# Altium schematic sheet FinalSchematic.SchDoc
size B
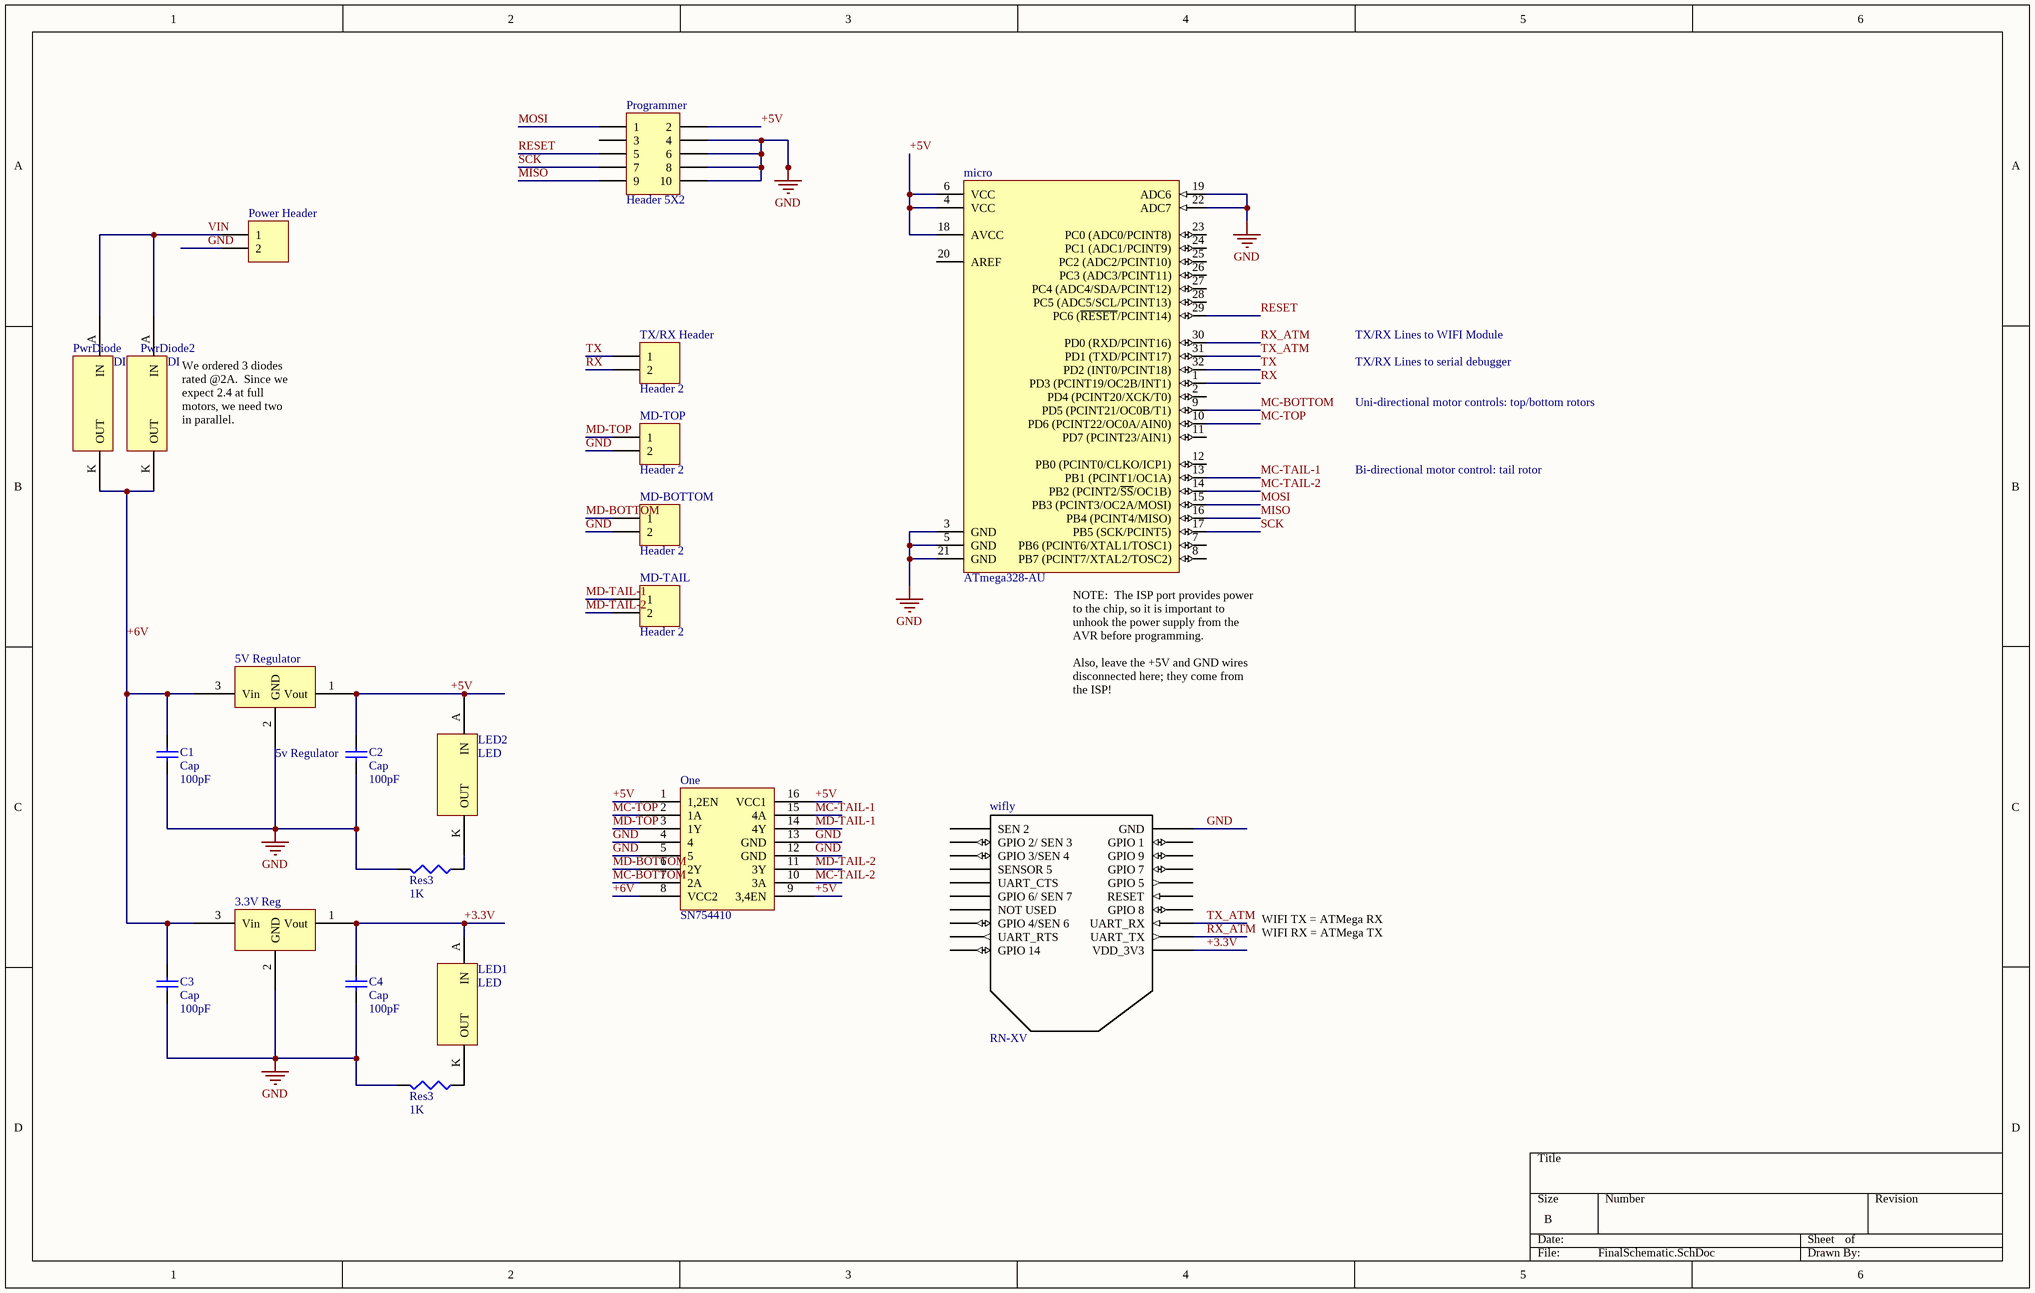
[diagram p0: FinalSchematic.SchDoc]

## Parts
3.3V_Reg  TO-220 3.3 V Regulator  [SOT89-150P410X160-3N]  (value not drawn)
5V_Regulator  5v Regulator  [SOT89-150P360X170-3N]
C1  Cap  value 100pF  [C1206]
C2  Cap  value 100pF  [C0805]
C3  Cap  value 100pF  [C1206]
C4  Cap  value 100pF  [C0805]
LED1  LED  [LEDFixed]
LED2  LED  [LEDFixed]
MD-BOTTOM  Header 2  [HDR1X2]
MD-TAIL  Header 2  [HDR1X2]
MD-TOP  Header 2  [HDR1X2]
micro  ATmega328-AU  [32A_L]
One  SN754410  [DIP-16]
Power_Header  Header 2  [HDR1X2]  (value not drawn)
Programmer  Header 5X2  [HDR2X5]
PwrDiode  DIODE  [Diode]
PwrDiode2  DIODE  [Diode]
R5  Res3  value 1K  [J1-0603]
R6  Res3  value 1K  [J1-0603]
TX/RX_Header  Header 2  [HDR1X2]
wifly  RN-XV  [XBEE]

## Nets
GND: 3.3V_Reg.2(GND) 5V_Regulator.2(GND) C1.1 C2.1 C3.1 C4.1 MD-BOTTOM.2 MD-TOP.2 micro.3(GND) micro.5(GND) micro.19(ADC6) micro.21(GND) micro.22(ADC7) One.4 One.5 One.12(GND) One.13(GND) Power_Header.2 Programmer.4 Programmer.6 Programmer.8 Programmer.10 R5.2 R6.2 wifly.10(GND)
+3.3V: 3.3V_Reg.1(Vout) C4.2 LED1.A(IN) wifly.1(VDD_3V3)
+5V: 5V_Regulator.1(Vout) C2.2 LED2.A(IN) micro.4(VCC) micro.6(VCC) micro.18(AVCC) One.1(1,2EN) One.9(3,4EN) One.16(VCC1) Programmer.2
+6V: 3.3V_Reg.3(Vin) 5V_Regulator.3(Vin) C1.2 C3.2 One.8(VCC2) PwrDiode.K(OUT) PwrDiode2.K(OUT)
MC-BOTTOM: micro.9(PD5_(PCINT21/OC0B/T1)) One.7(2A)
MC-TAIL-1: micro.13(PB1_(PCINT1/OC1A)) One.15(4A)
MC-TAIL-2: micro.14(PB2_(PCINT2/~{SS}/OC1B)) One.10(3A)
MC-TOP: micro.10(PD6_(PCINT22/OC0A/AIN0)) One.2(1A)
MD-BOTTOM: MD-BOTTOM.1 One.6(2Y)
MD-TAIL-1: MD-TAIL.1 One.14(4Y)
MD-TAIL-2: MD-TAIL.2 One.11(3Y)
MD-TOP: MD-TOP.1 One.3(1Y)
MISO: micro.16(PB4_(PCINT4/MISO)) Programmer.9
MOSI: micro.15(PB3_(PCINT3/OC2A/MOSI)) Programmer.1
RESET: micro.29(PC6_(~{RESET}/PCINT14)) Programmer.5
RX: micro.1(PD3_(PCINT19/OC2B/INT1)) TX/RX_Header.2
RX_ATM: micro.30(PD0_(RXD/PCINT16)) wifly.2(UART_TX)
SCK: micro.17(PB5_(SCK/PCINT5)) Programmer.7
TX: micro.32(PD2_(INT0/PCINT18)) TX/RX_Header.1
TX_ATM: micro.31(PD1_(TXD/PCINT17)) wifly.3(UART_RX)
VIN: Power_Header.1 PwrDiode.A(IN) PwrDiode2.A(IN)
NetLED1_K: LED1.K(OUT) R6.1
NetLED2_K: LED2.K(OUT) R5.1

Not connected (* = marked no-connect by the designer): micro 2(PD4_(PCINT20/XCK/T0)) 7(PB6_(PCINT6/XTAL1/TOSC1)) 8(PB7_(PCINT7/XTAL2/TOSC2)) 11(PD7_(PCINT23/AIN1)) 12(PB0_(PCINT0/CLKO/ICP1)) 20(AREF) 23(PC0_(ADC0/PCINT8)) 24(PC1_(ADC1/PCINT9)) 25(PC2_(ADC2/PCINT10)) 26(PC3_(ADC3/PCINT11)) 27(PC4_(ADC4/SDA/PCINT12)) 28(PC5_(ADC5/SCL/PCINT13)); Programmer 3; wifly 4(GPIO_8) 5(RESET) 6(GPIO_5) 7(GPIO_7) 8(GPIO_9) 9(GPIO_1) 11(GPIO_14) 12(UART_RTS) 13(GPIO_4/SEN_6) 14(NOT_USED) 15(GPIO_6/_SEN_7) 16(UART_CTS) 17(SENSOR_5) 18(GPIO_3/SEN_4) 19(GPIO_2/_SEN_3) 20(SEN_2)

## Notes on the sheet
- TX/RX Lines to WIFI Module
- TX/RX Lines to serial debugger
- (near PwrDiode2) We ordered 3 diodes rated @2A.  Since we expect 2.4 at full motors, we need two in parallel.
- Uni-directional motor controls: top/bottom rotors
- Bi-directional motor control: tail rotor
- (near micro) NOTE:  The ISP port provides power to the chip, so it is important to unhook the power supply from the AVR before programming.
  Also, leave the +5V and GND wires disconnected here; they come from the ISP!
- WIFI TX = ATMega RX
  WIFI RX = ATMega TX

## Library data of the parts
C1-C4 = Cap: Capacitor; Published: 8-Jun-2000; LatestRevisionDate: 17-Jul-2002; LatestRevisionNote: Re-released for DXP Platform.; PackageReference: RAD-0.3; Publisher: Altium Limited; PackageDescription: Radial Cap, Thru-Hole; 2 Leads; 0.3 in Pin Spacing
MD-BOTTOM MD-TAIL MD-TOP Power_Header TX/RX_Header = Header 2: Header, 2-Pin; LatestRevisionDate: 17-Jul-2002; LatestRevisionNote: Re-released for DXP Platform.; Publisher: Altium Limited
micro = ATmega328-AU: 8-bit AVR Microcontroller, 32KB Flash, 1KB EEPROM, 2KB SRAM, 32-pin TQFP, Industrial Grade (-40°C to 85°C); Published: 1-Apr-2010; DatasheetVersion: revA, Jan-2010; PackageVersion: revB, Oct-2001; PackageReference: 32A; Publisher: Altium Limited; PackageDescription: 32-Lead, 7x7x1.0 mm Body, 0.8mm Lead Pitch, Thin Profile Plastic Quad Flat Package (TQFP); Supplier 1: Digi-Key; Supplier Part Number 1: ATMEGA328-AU-ND; Supplier 2: Mouser; Supplier Part Number 2: 556-ATMEGA328-AU; Code_JEDEC: MS-026-ABA; ComponentLink1Description: Manufacturer Link; ComponentLink1URL: http://www.atmel.com/products/avr/default.asp?; ComponentLink2Description: ATmega48A/48PA/88A/88PA/168A/168PA/328/328P Datasheet; ComponentLink2URL: http://www.atmel.com/dyn/resources/prod_documents/8271.pdf; ComponentLink3Description: ATmega48A/48PA/88A/88PA/168A/168PA/328/328P Summary; ComponentLink3URL: http://www.atmel.com/dyn/resources/prod_documents/8271S.pdf; ComponentLink4Description: Atmel.com Home; ComponentLink4URL: http://www.atmel.com
Programmer = Header 5X2: Header, 5-Pin, Dual row; LatestRevisionDate: 17-Jul-2002; LatestRevisionNote: Re-released for DXP Platform.; Publisher: Altium Limited
R5 R6 = Res3: Resistor; Published: 8-Jun-2000; LatestRevisionDate: 29-May-2009; LatestRevisionNote: IPC-7351 Footprint Added.; PackageReference: J1-0603; Publisher: Altium Limited; PackageDescription: Chip Resistor